# EAGLE design Adafruit Mini Analog Thumbstick (EAGLE 6.6.0)
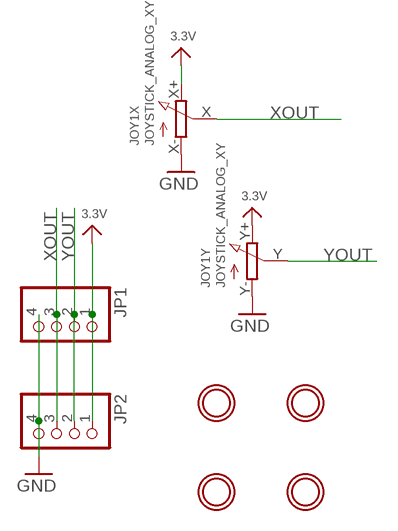
[diagram p0: schematic, sheet 1]

## Parts
JOY1  JOYSTICK_ANALOG_XY  [JOYSTICK_ANALOG_MINITHM]
JP1  HEADER-1X476MIL  [1X04_ROUND_76]
JP2  HEADER-1X476MIL  [1X04_ROUND_76]
U$1  MOUNTINGHOLE2.0  [MOUNTINGHOLE_2.0_PLATED]
U$4  MOUNTINGHOLE2.0  [MOUNTINGHOLE_2.0_PLATED]
U$5  MOUNTINGHOLE2.0  [MOUNTINGHOLE_2.0_PLATED]
U$6  MOUNTINGHOLE2.0  [MOUNTINGHOLE_2.0_PLATED]

## Nets
3.3V: JOY1.X+(X:E) JOY1.Y+(Y:E) JP1.1 JP2.1
GND: JOY1.X-(X:A) JOY1.Y-(Y:A) JP1.4 JP2.4
XOUT: JOY1.X(X:S) JP1.3 JP2.3
YOUT: JOY1.Y(Y:S) JP1.2 JP2.2

## Library data of the parts
JOY1 = microbuilder:JOYSTICK_ANALOG_XY
JP1 JP2 = microbuilder:HEADER-1X4: PIN HEADER
U$1 U$4-U$6 = microbuilder:MOUNTINGHOLE: Mounting Hole For #2 screws (0.086"/2.18mm width, 0.094"/2.4mm hole) use 2.5mm; BOM: EXCLUDE

## Board
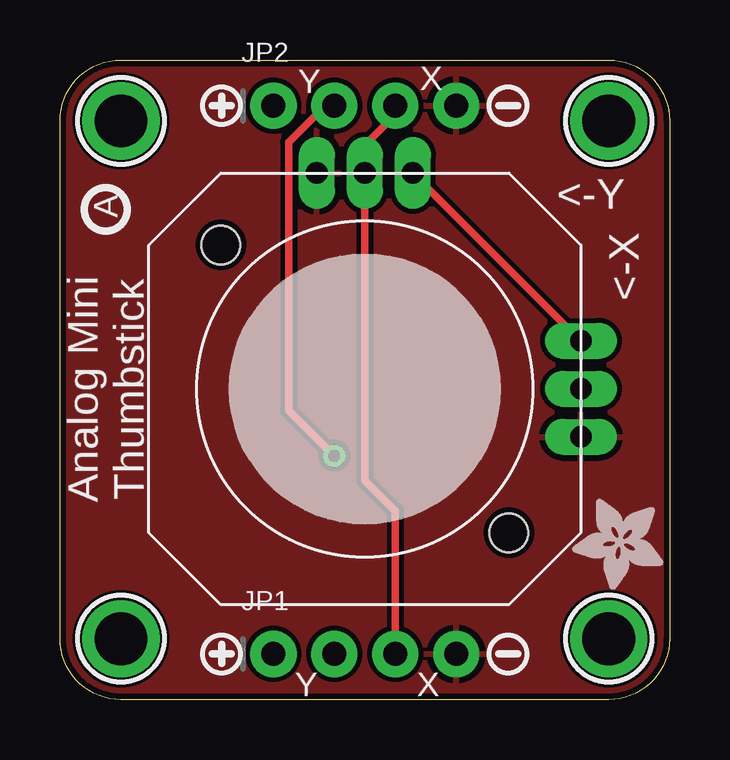
[diagram p1: board, top side]
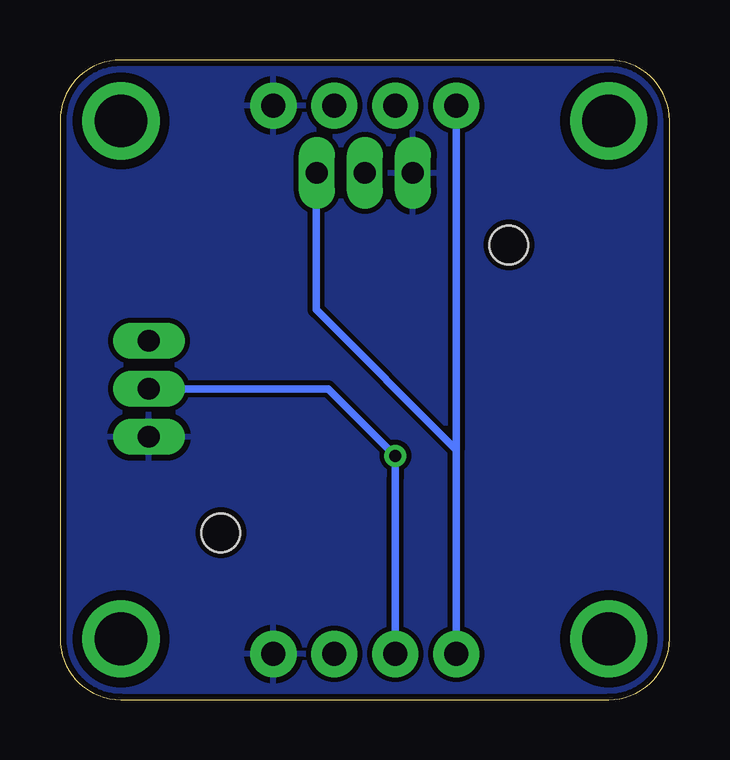
[diagram p2: board, bottom side, seen from below]

Size 25.4 x 26.67 mm. Coordinates in mm from the lower left corner, seen from the top.
Outline: 22.86,0 2.54,0 arc-90 0,2.54 0,24.13 arc-90 2.54,26.67 22.86,26.67 arc-90 25.4,24.13 25.4,2.54 arc-90 22.86,0
Copper layers (1*16): Top 0.035mm / dielectric 1.5mm / Bottom 0.035mm
Design rules "adafruit": minimum track width 8mil, minimum drill 15.5mil, track to track 8mil, track to pad 8mil, pad to pad 8mil, via to via 8mil, smd to smd 8mil, copper to edge 10mil, drill to drill 8mil, minimum pad ring 10mil, minimum via ring 8mil, stop-mask expansion 2mil, vias tented up to drill 20mil, thermal gap 10mil

### Footprints (pad centres in the part's own frame; a part is rotated, then mirrored left to right if it is on the bottom)
JOYSTICK_ANALOG_MINITHM = drill 0.9 pad 1.5 long: X 0,9; X+ 2,9; X- -2,9; Y 9,0; Y+ 9,2; Y- 9,-2 | hole 1.6: -6,6; 6,-6
1X04_ROUND_76 = drill 1 pad 1.93: 1 -3.81,0; 2 -1.27,0; 3 1.27,0; 4 3.81,0
MOUNTINGHOLE_2.0_PLATED = drill 2.2 pad 3: P$1 0,0

### Placement (x,y rotation side)
JOY1  12.7,12.95 0 top
JP1  12.7,1.91 0 top
JP2  12.7,24.77 0 top
U$1  22.86,2.54 0 top
U$4  2.54,2.54 0 top
U$5  22.86,24.13 0 top
U$6  2.54,24.13 0 top
U$8  [ADAFRUIT_3.5MM]  25.15,8.38 180 top
U$9  [SYMBOL_PLUS]  6.73,1.91 0 top
U$10  [SYMBOL_PLUS]  6.73,24.77 0 top
U$11  [SYMBOL_MINUS]  18.67,24.77 0 top
U$12  [SYMBOL_MINUS]  18.67,1.91 0 top
U$13  [PCBFEAT-REV-040]  1.91,20.45 90 top

### Tracks (layer width: path | path; a pad name or v marks a point on that pad's centre or on a via)
3.3V
  Top 0.305: JOY1.Y+ JOY1.X+
  Bottom 0.305: JP1.1 8.89,10.41 | 8.89,10.41 14.73,16.26 14.73,22.94 JOY1.X+ | JP2.1 8.89,10.41
GND
  pour Top: 0,26.67 0,0 25.4,0 25.4,26.67
  pour Bottom: 0,26.67 0,0 25.4,0 25.4,26.67
XOUT
  Top 0.305: JP1.3 13.97,7.87 12.7,9.14 JOY1.X 12.7,23.11 13.97,24.38 JP2.3
YOUT  (via drill 0.5)
  Top 0.305: JP2.2 11.05,24.77 9.53,23.24 9.53,12.06 v11.43,10.16
  Bottom 0.305: JP1.2 11.43,9.27 v11.43,10.16 14.22,12.95 JOY1.Y

### Text on the board
tPlace: Y | X | <-Y | <-X | Analog Mini / Thumbstick | Y | X